# Altium schematic sheet Power Regulator Breakout V1.SchDoc
size A4; SheetNumber: 1; SheetTotal: 2
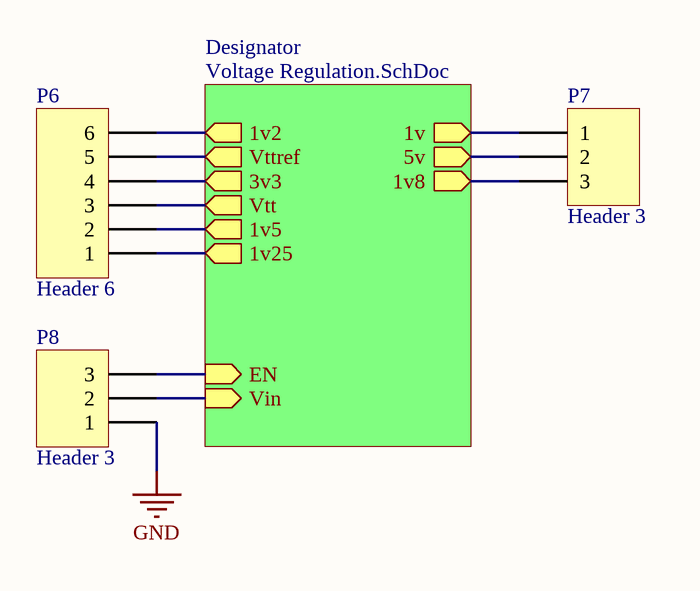
[diagram p0: Power Regulator Breakout V1.SchDoc]

## Parts
P6  Header 6  [HDR1X6]
P7  Header 3  [HDR1X3]
P8  Header 3  [HDR1X3]

## Sub-sheets
Designator = Voltage Regulation.SchDoc: Vtt (out), 1v (out), 1v2 (out), 5v (out), 3v3 (out), 1v5 (out), Vin (in), Vttref (out), EN (in), 1v8 (out), 1v25 (out)

## Nets
GND: P8.1
NetP6_1: P6.1 ; sheet Designator/1v25
NetP6_2: P6.2 ; sheet Designator/1v5
NetP6_3: P6.3 ; sheet Designator/Vtt
NetP6_4: P6.4 ; sheet Designator/3v3
NetP6_5: P6.5 ; sheet Designator/Vttref
NetP6_6: P6.6 ; sheet Designator/1v2
NetP7_1: P7.1 ; sheet Designator/1v
NetP7_2: P7.2 ; sheet Designator/5v
NetP7_3: P7.3 ; sheet Designator/1v8
NetP8_2: P8.2 ; sheet Designator/Vin
NetP8_3: P8.3 ; sheet Designator/EN

## Library data of the parts
P6 = Header 6: Header, 6-Pin; LatestRevisionDate: 17-Jul-2002; LatestRevisionNote: Re-released for DXP Platform.; Publisher: Altium Limited
P7 P8 = Header 3: Header, 3-Pin; LatestRevisionDate: 17-Jul-2002; LatestRevisionNote: Re-released for DXP Platform.; Publisher: Altium Limited